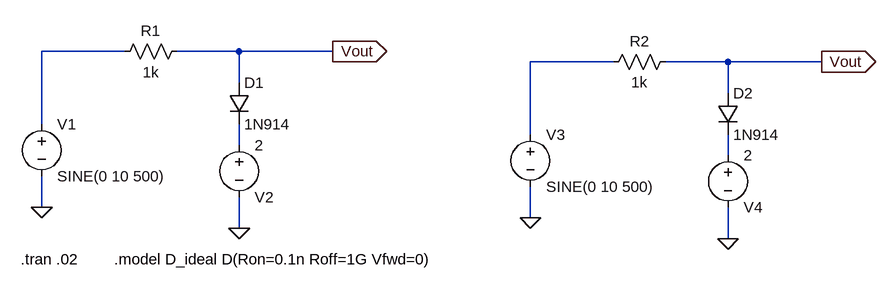
[diagram p0: schematic Q1a.asc]
Q1a.asc, the LTspice schematic file:
Version 4
SHEET 1 1764 680
WIRE -160 16 -288 16
WIRE 16 16 -80 16
WIRE 160 16 16 16
WIRE 592 32 464 32
WIRE 768 32 672 32
WIRE 912 32 768 32
WIRE 16 64 16 16
WIRE 768 80 768 32
WIRE -288 128 -288 16
WIRE 464 144 464 32
WIRE 16 160 16 128
WIRE 768 176 768 144
WIRE -288 256 -288 208
WIRE 464 272 464 224
WIRE 16 288 16 240
WIRE 768 304 768 256
FLAG -288 256 0
FLAG 16 288 0
FLAG 160 16 Vout
IOPIN 160 16 Out
FLAG 464 272 0
FLAG 768 304 0
FLAG 912 32 Vout
IOPIN 912 32 Out
SYMBOL voltage -288 112 R0
WINDOW 123 0 0 Left 0
WINDOW 39 0 0 Left 0
SYMATTR InstName V1
SYMATTR Value SINE(0 10 500)
SYMBOL res -64 0 R90
WINDOW 0 0 56 VBottom 2
WINDOW 3 32 56 VTop 2
SYMATTR InstName R1
SYMATTR Value 1k
SYMBOL diode 0 64 R0
SYMATTR InstName D1
SYMATTR Value 1N914
SYMBOL voltage 16 144 R0
WINDOW 0 24 96 Left 2
WINDOW 3 24 16 Left 2
WINDOW 123 0 0 Left 0
WINDOW 39 0 0 Left 0
SYMATTR InstName V2
SYMATTR Value 2
SYMBOL voltage 464 128 R0
WINDOW 123 0 0 Left 0
WINDOW 39 0 0 Left 0
SYMATTR InstName V3
SYMATTR Value SINE(0 10 500)
SYMBOL res 688 16 R90
WINDOW 0 0 56 VBottom 2
WINDOW 3 32 56 VTop 2
SYMATTR InstName R2
SYMATTR Value 1k
SYMBOL diode 752 80 R0
SYMATTR InstName D2
SYMATTR Value 1N914
SYMBOL voltage 768 160 R0
WINDOW 0 24 96 Left 2
WINDOW 3 24 16 Left 2
WINDOW 123 0 0 Left 0
WINDOW 39 0 0 Left 0
SYMATTR InstName V4
SYMATTR Value 2
TEXT -176 336 Left 2 !.model D_ideal D(Ron=0.1n Roff=1G Vfwd=0)
TEXT -320 336 Left 2 !.tran .02

The netlist it stands for:
* Q1a.asc
V1 N001 0 SINE(0 10 500)
R1 Vout N001 1k
D1 Vout N003 1N914
V2 N003 0 2
V3 N002 0 SINE(0 10 500)
R2 Vout N002 1k
D2 Vout N004 1N914
V4 N004 0 2
.model D D
.lib standard.dio
.model D_ideal D(Ron=0.1n Roff=1G Vfwd=0)
.tran .02
.backanno
.end